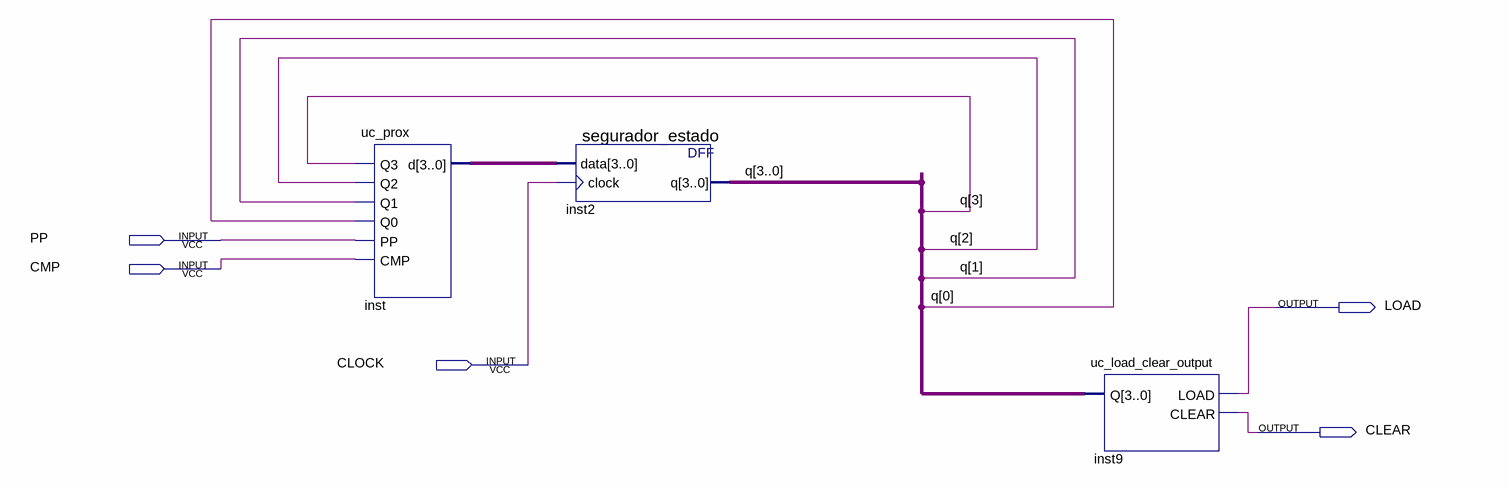
[diagram p0: schematic sheet]
// Quartus schematic unidadeControle.bdf as structural Verilog: 3 symbols, 5 pins
module unidadeControle (
  input  PP,
  input  CMP,
  input  CLOCK,
  output LOAD,
  output CLEAR
);

  wire [3:0] inst_d, q;

  uc_prox inst (.Q3(q[3]), .Q2(q[2]), .Q1(q[1]), .Q0(q[0]), .PP(PP), .CMP(CMP), .d(inst_d));
  segurador_estado inst2 (.data(inst_d), .clock(CLOCK), .q(q));
  uc_load_clear_output inst9 (.Q(q), .LOAD(LOAD), .CLEAR(CLEAR));
endmodule
